# EAGLE design ExpansionHub (EAGLE 6.1)
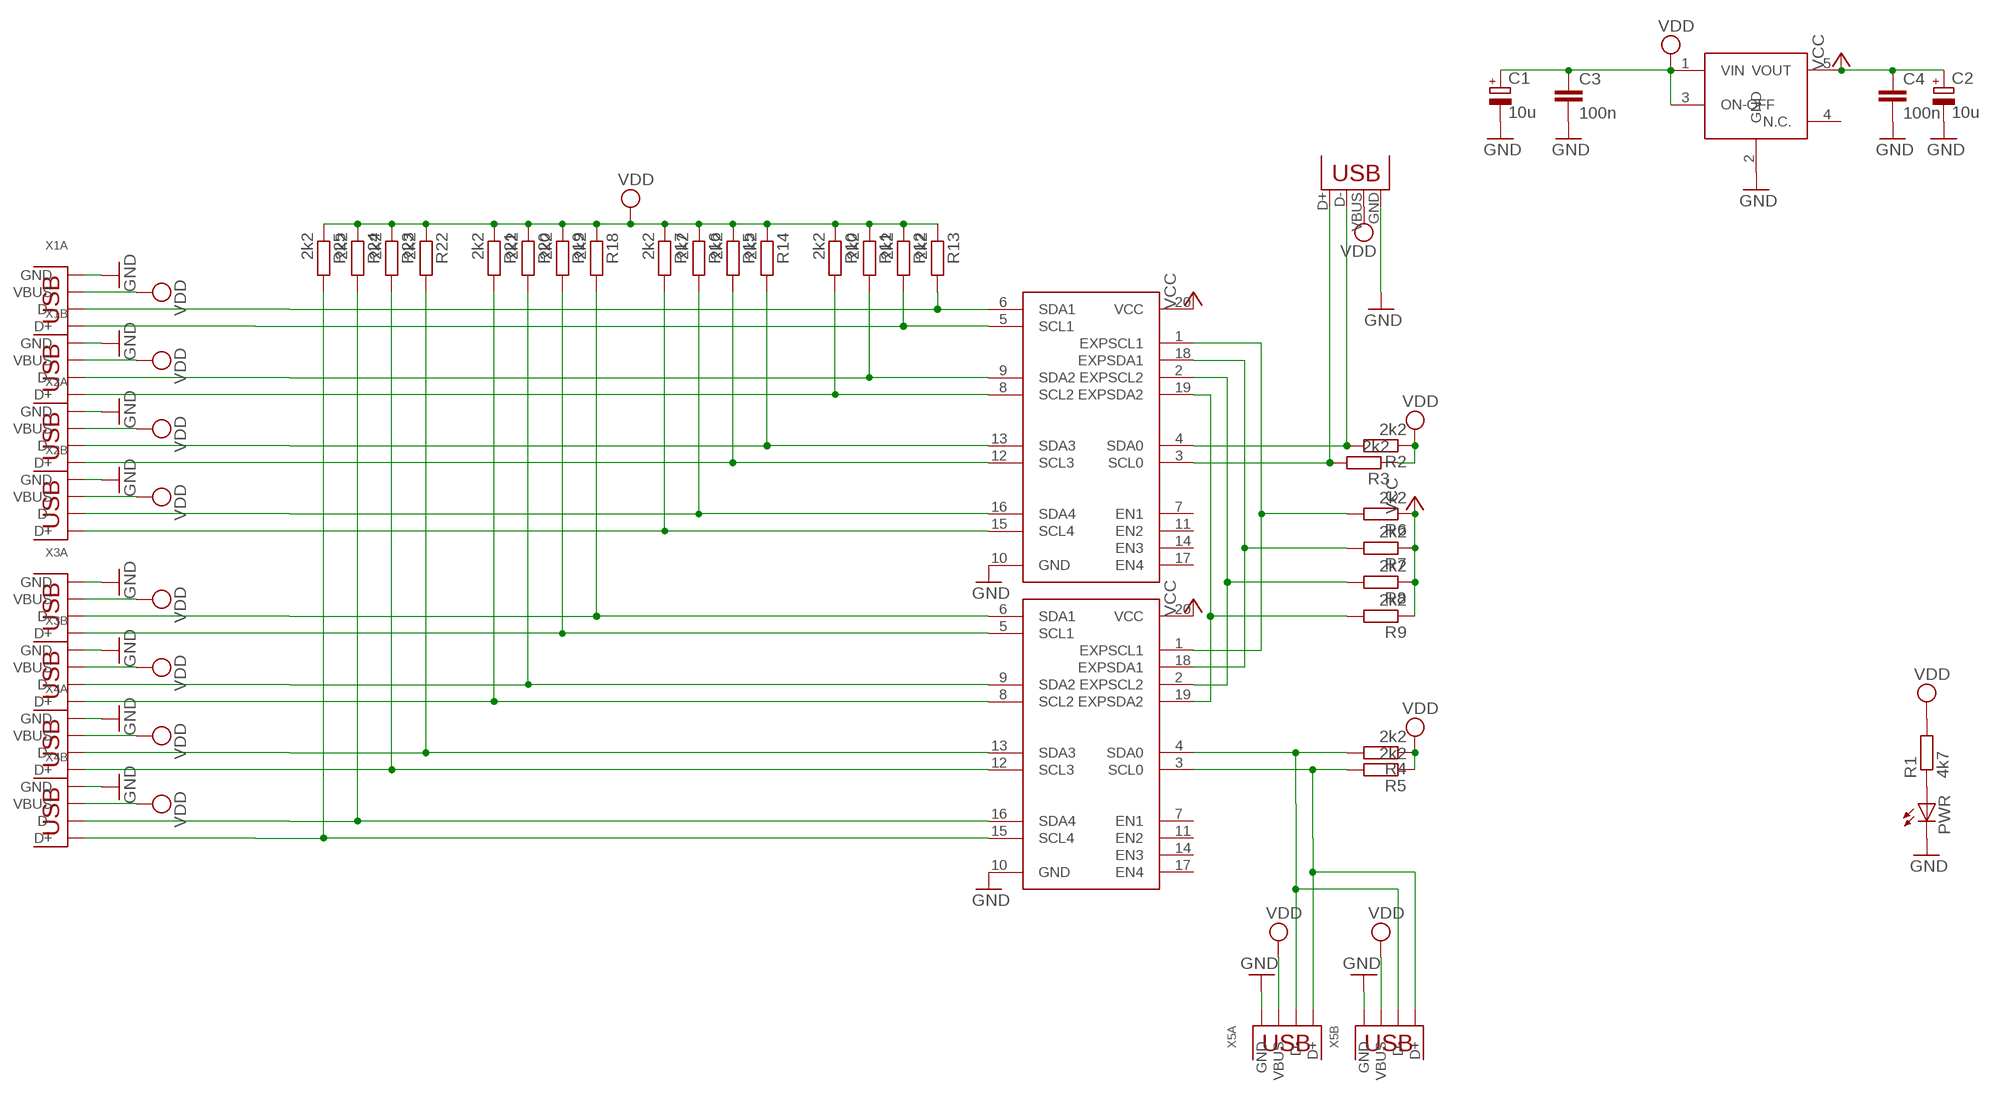
[diagram p0: schematic, sheet 1]

## Parts
C1  10u  CPOL-EUA/3216-18W  [A/3216-18W]
C2  10u  CPOL-EUA/3216-18W  [A/3216-18W]
C3  100n  C-EUC0805  [C0805]
C4  100n  C-EUC0805  [C0805]
IC1  PCA9518  [TSSOP20]
IC2  PCA9518  [TSSOP20]
PWR  LED3MM  [LED3MM]
R1  4k7  R-EU_R0805W  [R0805W]
R2  2k2  R-EU_R0805  [R0805]
R3  2k2  R-EU_R0805  [R0805]
R4  2k2  R-EU_R0805  [R0805]
R5  2k2  R-EU_R0805  [R0805]
R6  2k2  R-EU_R0805  [R0805]
R7  2k2  R-EU_R0805  [R0805]
R8  2k2  R-EU_R0805  [R0805]
R9  2k2  R-EU_R0805  [R0805]
R10  2k2  R-EU_R0805  [R0805]
R11  2k2  R-EU_R0805  [R0805]
R12  2k2  R-EU_R0805  [R0805]
R13  2k2  R-EU_R0805  [R0805]
R14  2k2  R-EU_R0805  [R0805]
R15  2k2  R-EU_R0805  [R0805]
R16  2k2  R-EU_R0805  [R0805]
R17  2k2  R-EU_R0805  [R0805]
R18  2k2  R-EU_R0805  [R0805]
R19  2k2  R-EU_R0805  [R0805]
R20  2k2  R-EU_R0805  [R0805]
R21  2k2  R-EU_R0805  [R0805]
R22  2k2  R-EU_R0805  [R0805]
R23  2k2  R-EU_R0805  [R0805]
R24  2k2  R-EU_R0805  [R0805]
R25  2k2  R-EU_R0805  [R0805]
U1  LP2985  [SOT23-5]
X1  DUA-USB  [DUAL]
X2  DUA-USB  [DUAL]
X3  DUA-USB  [DUAL]
X4  DUA-USB  [DUAL]
X5  DUA-USB  [DUAL]
X11  USBSMD  [USB-MINIB]

## Nets
GND [gnd]: C1.- C2.- C3.2 C4.2 IC1.10(GND) IC2.10(GND) PWR.K(C) U1.2(GND) X1.1-4(A:GND) X1.2-4(B:GND) X2.1-4(A:GND) X2.2-4(B:GND) X3.1-4(A:GND) X3.2-4(B:GND) X4.1-4(A:GND) X4.2-4(B:GND) X5.1-4(A:GND) X5.2-4(B:GND) X11.GND
N$1: IC1.19(EXPSDA2) IC2.19(EXPSDA2) R9.2
N$2: IC1.2(EXPSCL2) IC2.2(EXPSCL2) R8.2
N$3: IC1.18(EXPSDA1) IC2.18(EXPSDA1) R7.2
N$4: IC1.4(SDA0) R2.2 X11.D-
N$5: IC1.3(SCL0) R3.2 X11.D+
N$6: IC1.1(EXPSCL1) IC2.1(EXPSCL1) R6.2
N$7: IC2.3(SCL0) R5.2 X5.1-3(A:D+) X5.2-3(B:D+)
N$8: IC2.4(SDA0) R4.2 X5.1-2(A:D-) X5.2-2(B:D-)
N$9: IC1.9(SDA2) R11.2 X1.2-2(B:D-)
N$10: PWR.A R1.1
N$11: IC2.15(SCL4) R25.2 X4.2-3(B:D+)
N$12: IC1.8(SCL2) R10.2 X1.2-3(B:D+)
N$13: IC2.16(SDA4) R24.2 X4.2-2(B:D-)
N$14: IC1.12(SCL3) R15.2 X2.1-3(A:D+)
N$16: IC1.15(SCL4) R17.2 X2.2-3(B:D+)
N$18: IC2.5(SCL1) R19.2 X3.1-3(A:D+)
N$20: IC2.8(SCL2) R21.2 X3.2-3(B:D+)
N$22: IC2.12(SCL3) R23.2 X4.1-3(A:D+)
N$25: IC1.6(SDA1) R13.2 X1.1-2(A:D-)
N$26: IC1.13(SDA3) R14.2 X2.1-2(A:D-)
N$28: IC1.16(SDA4) R16.2 X2.2-2(B:D-)
N$30: IC2.6(SDA1) R18.2 X3.1-2(A:D-)
N$32: IC2.9(SDA2) R20.2 X3.2-2(B:D-)
N$34: IC2.13(SDA3) R22.2 X4.1-2(A:D-)
N$49: IC1.5(SCL1) R12.2 X1.1-3(A:D+)
VCC: C2.+ C4.1 IC1.20(VCC) IC2.20(VCC) R6.1 R7.1 R8.1 R9.1 U1.5(VOUT)
VDD: C1.+ C3.1 R1.2 R2.1 R3.1 R4.1 R5.1 R10.1 R11.1 R12.1 R13.1 R14.1 R15.1 R16.1 R17.1 R18.1 R19.1 R20.1 R21.1 R22.1 R23.1 R24.1 R25.1 U1.1(VIN) U1.3(ON-OFF) X1.1-1(A:VBUS) X1.2-1(B:VBUS) X2.1-1(A:VBUS) X2.2-1(B:VBUS) X3.1-1(A:VBUS) X3.2-1(B:VBUS) X4.1-1(A:VBUS) X4.2-1(B:VBUS) X5.1-1(A:VBUS) X5.2-1(B:VBUS) X11.VBUS
Unconnected: IC1.7(EN1) IC1.11(EN2) IC1.14(EN3) IC1.17(EN4) IC2.7(EN1) IC2.11(EN2) IC2.14(EN3) IC2.17(EN4) U1.4(N.C.)

## Library data of the parts
C1 C2 = rcl:CPOL-EU: POLARIZED CAPACITOR, European symbol
C3 C4 = rcl:C-EU: CAPACITOR, European symbol
IC1 IC2 = PCA95XX:PCA9518
PWR = led:LED: LED OSRAM: - CHIPLED LG R971, LG N971, LY N971, LG Q971, LY Q971, LO R971, LY R971 LH N974, LH R974 LS Q976, LO Q976, LY Q976 LO Q996 - Hyper CHIPLED LW Q18S LB Q993, LB Q99A, LB R99A - SideLED LS A670, LO A670, LY A670, LG A670, LP A670 LB A673, LV A673, LT A673, LW A673 LH A674 LY A675 LS A676, LA A676, LO A676, LY A676, LW A676 LS A679, LY A679, LG A679 - Hyper Micro SIDELED® LS Y876, LA Y876, LO Y876, LY Y876 LT Y87S - SmartLED LW L88C, LW L88S LB L89C, LB L89S, LG L890 LS L89K, LO L89K, LY L89K LS L896, LA L896, LO L896, LY L896 - TOPLED LS T670, LO T670, LY T670, LG T670, LP T670 LSG T670, LSP T670, LSY T670, LOP T670, LYG T670 LG T671, LOG T671, LSG T671 LB T673, LV T673, LT T673, LW T673 LH T674 LS T676, LA T676, LO T676, LY T676, LB T676, LH T676, LSB T676, LW T676 LB T67C, LV T67C, LT T67C, LS T67K, LO T67K, LY T67K, LW E67C LS E67B, LA E67B, LO E67B, LY E67B, LB E67C, LV E67C, LT E67C LW T67C LS T679, LY T679, LG T679 LS T770, LO T770, LY T770, LG T770, LP T770 LB T773, LV T773, LT T773, LW T773 LH T774 LS E675, LA E675, LY E675, LS T675 LS T776, LA T776, LO T776, LY T776, LB T776 LHGB T686 LT T68C, LB T68C - Hyper Mini TOPLED® LB M676 - Mini TOPLED Santana® LG M470 LS M47K, LO M47K, LY M47K Source: http://www.osram.convergy.de LUXEON: - LUMILED® LXK2-PW12-R00, LXK2-PW12-S00, LXK2-PW14-U00, LXK2-PW14-V00 LXK2-PM12-R00, LXK2-PM12-S00, LXK2-PM14-U00 LXK2-PE12-Q00, LXK2-PE12-R00, LXK2-PE12-S00, LXK2-PE14-T00, LXK2-PE14-U00 LXK2-PB12-K00, LXK2-PB12-L00, LXK2-PB12-M00, LXK2-PB14-N00, LXK2-PB14-P00, LXK2-PB14-Q00 LXK2-PR12-L00, LXK2-PR12-M00, LXK2-PR14-Q00, LXK2-PR14-R00 LXK2-PD12-Q00, LXK2-PD12-R00, LXK2-PD12-S00 LXK2-PH12-R00, LXK2-PH12-S00 LXK2-PL12-P00, LXK2-PL12-Q00, LXK2-PL12-R00 Source: www.luxeon.com KINGBRIGHT: KA-3528ASYC Source: www.kingbright.com
R1-R25 = rcl:R-EU_: RESISTOR, European symbol
U1 = LP2985:LP2985
X1-X5 = con-cypressindustries:DUA-USB
X11 = SparkFun:USB: USB Connectors USB-B-PTH is fully proven SKU : PRT-00139 USB-miniB is fully proven SKU : PRT-00587 USB-A-PCB is untested. USB-A-H is throughly reviewed, but untested. Spark Fun Electronics SKU : PRT-00437 USB-B-SMT is throughly reviewed, but untested. Needs silkscreen touching up. USB-A-S has not been used/tested USB-MB-H has not been used/tested

## Net classes
0 default: width 0.305 mm, drill 0.305 mm, clearance 0.203 mm
2 gnd: width 0.305 mm, drill 0.305 mm, clearance 0.203 mm

## Board
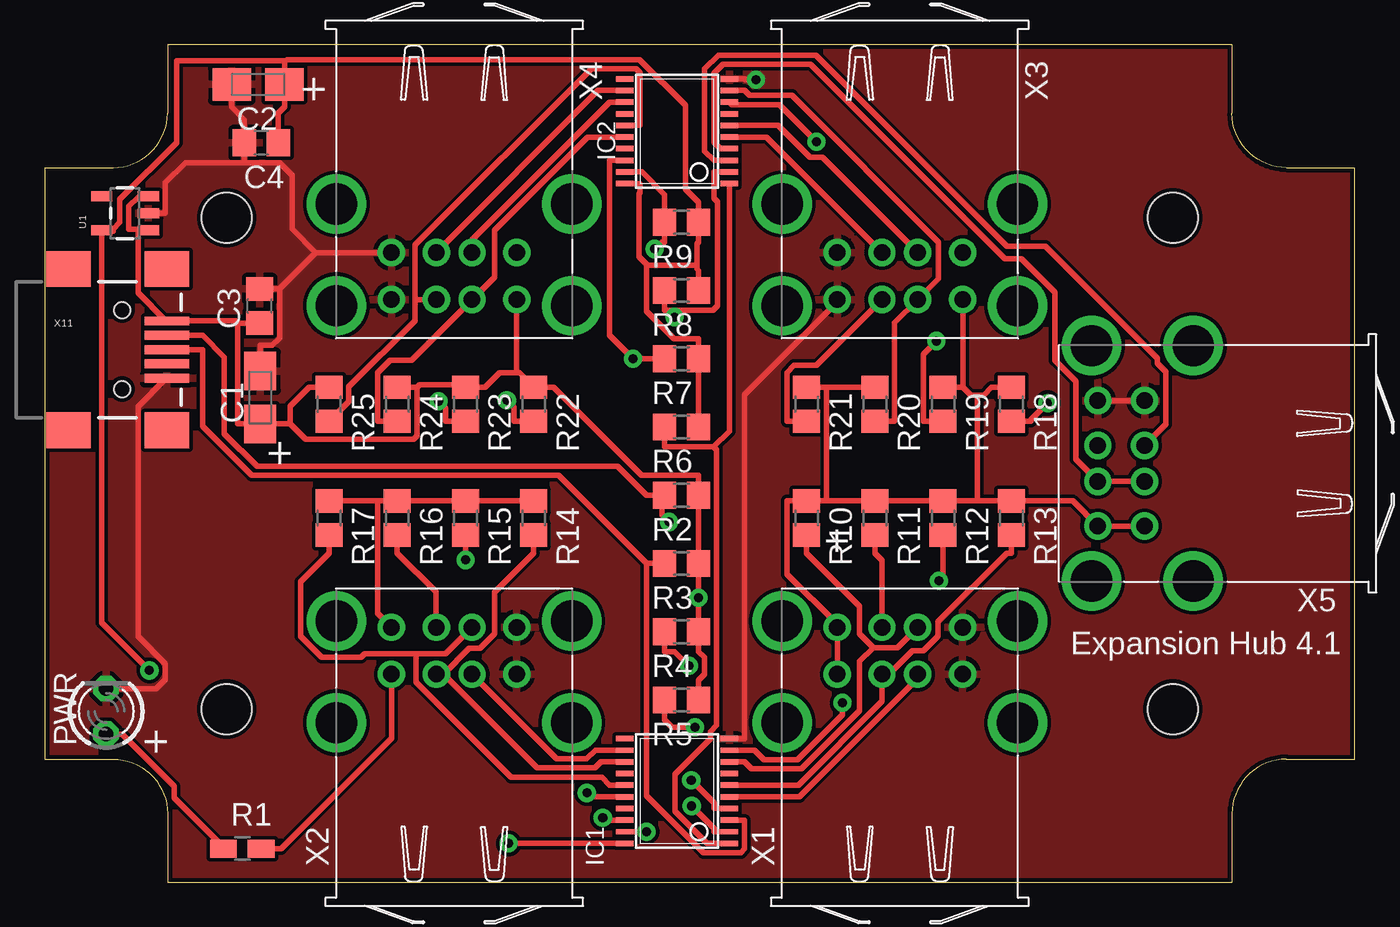
[diagram p1: board, top side]
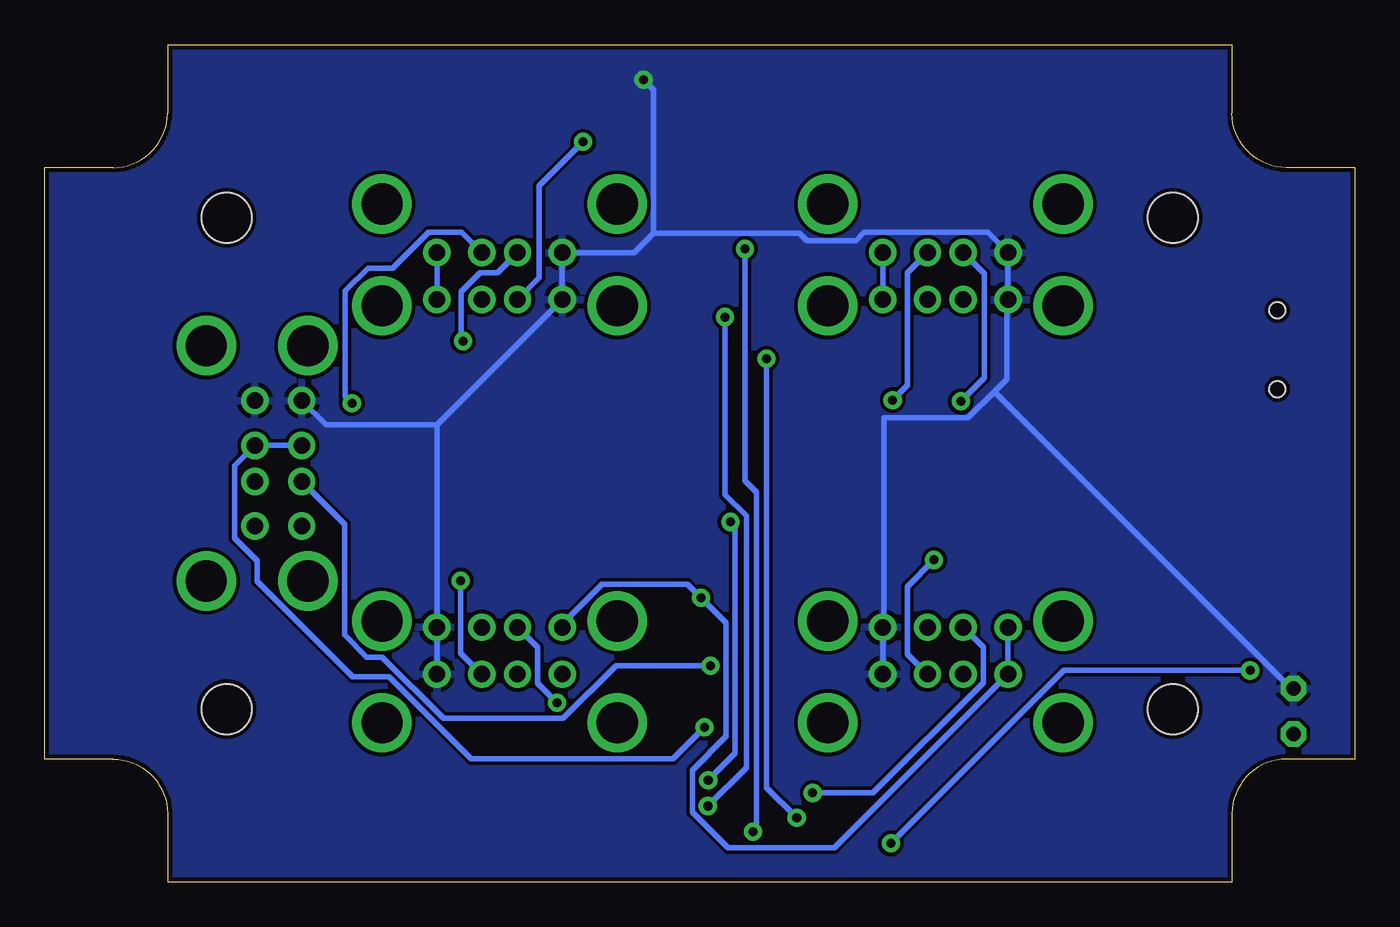
[diagram p2: board, bottom side, seen from below]

Size 73.15 x 46.74 mm. Coordinates in mm from the lower left corner, seen from the top.
Outline: 0,39.88 0,6.86 3.81,6.86 arc-90 6.86,3.81 6.86,0 66.29,0 66.29,3.81 arc-90 69.34,6.86 73.15,6.86 73.15,39.88 69.34,39.88 arc-90 66.29,42.93 66.29,46.74 6.86,46.74 6.86,42.93 arc-90 3.81,39.88 0,39.88
Copper layers (1*16): Top 0.035mm / dielectric 1.5mm / Bottom 0.035mm
Design rules: minimum track width 8mil, minimum drill 20mil, track to track 8mil, track to pad 8mil, pad to pad 8mil, via to via 8mil, smd to smd 8mil, copper to edge 10mil, drill to drill 8mil, minimum pad ring 12mil, minimum via ring 10mil, stop-mask expansion 4mil, vias tented up to drill 25mil, thermal gap 10mil
Holes 2.8 mm at 10.16,37.08 10.16,9.65 62.99,9.65 62.99,37.08

### Footprints (pad centres in the part's own frame; a part is rotated, then mirrored left to right if it is on the bottom)
A/3216-18W = smd 2.15 x 1.8: + 1.475,0; - -1.475,0
C0805 = smd 1.3 x 1.5: 1 -0.95,0; 2 0.95,0
TSSOP20 = smd 0.305 x 0.991: 1 -2.925,-2.918; 2 -2.275,-2.918; 3 -1.625,-2.918; 4 -0.975,-2.918; 5 -0.325,-2.918; 6 0.325,-2.918; 7 0.975,-2.918; 8 1.625,-2.918; 9 2.275,-2.918; 10 2.925,-2.918; 11 2.925,2.918; 12 2.275,2.918; 13 1.625,2.918; 14 0.975,2.918; 15 0.325,2.918; 16 -0.325,2.918; 17 -0.975,2.918; 18 -1.625,2.918; 19 -2.275,2.918; 20 -2.925,2.918
LED3MM = drill 0.813 octagon: A -1.27,0; K 1.27,0
R0805W = smd 1.5 x 1: 1 -1.052,0; 2 1.052,0
R0805 = smd 1.3 x 1.5: 1 -0.95,0; 2 0.95,0
SOT23-5 = smd 0.55 x 1.2: 1 -0.95,-1.3; 2 0,-1.3; 3 0.95,-1.3; 4 0.95,1.3; 5 -0.95,1.3
DUAL = drill 0.92 pad 1.27: 1-1 3.98,3.5; 1-2 3.98,1; 1-3 3.98,-1; 1-4 3.98,-3.5; 2-1 6.6,3.5; 2-2 6.6,1; 2-3 6.6,-1; 2-4 6.6,-3.5 | drill 2.3 pad 3: M1 1.27,6.57; M2 1.27,-6.57; M3 6.95,6.57; M4 6.95,-6.57
USB-MINIB = smd 2.5 x 0.5: D+ 2.5,0; D- 2.5,0.8; GND 2.5,-1.6; ID 2.5,-0.8; VBUS 2.5,1.6 | smd 2.5 x 2: GND@1 -3,-4.5; GND@2 -3,4.5; GND@3 2.5,4.5; GND@4 2.5,-4.5 | hole 0.9: 0,2.2; 0,-2.2

### Placement (x,y rotation side)
C1  12.03,27.05 270 top
C2  11.91,44.52 0 top
C3  12,32.16 90 top
C4  12.1,41.26 180 top
IC1  35.31,5.08 90 top
IC2  35.31,41.91 90 top
PWR  3.43,9.53 90 top
R1  11.03,1.86 0 top
R2  35.56,21.59 180 top
R3  35.56,17.78 180 top
R4  35.56,13.97 180 top
R5  35.56,10.16 180 top
R6  35.56,25.4 180 top
R7  35.56,29.21 180 top
R8  35.56,33.02 180 top
R9  35.56,36.83 180 top
R10  42.55,20.32 270 top
R11  46.35,20.32 270 top
R12  50.16,20.32 270 top
R13  53.98,20.32 270 top
R14  27.3,20.32 270 top
R15  23.5,20.32 270 top
R16  19.68,20.32 270 top
R17  15.88,20.32 270 top
R18  53.98,26.67 270 top
R19  50.16,26.67 270 top
R20  46.35,26.67 270 top
R21  42.55,26.67 270 top
R22  27.3,26.67 270 top
R23  23.5,26.67 270 top
R24  19.68,26.67 270 top
R25  15.88,26.67 270 top
U1  4.48,37.34 90 top
X1  47.75,7.62 90 top
X2  22.86,7.62 90 top
X3  47.75,39.12 270 top
X4  22.86,39.12 270 top
X5  65.41,23.37 180 top
X11  4.32,29.72 0 top

### Tracks (layer width: path | path; a pad name or v marks a point on that pad's centre or on a via)
GND  (via drill 0.51 pad 1.02)
  Top 0.305: v39.72,44.78 39.13,44.78 39.08,44.84 IC2.10 | IC1.10 39.08,8.01 39.08,27.2 44.25,32.38 X3.2-4 | 15.14,35.14 13.11,33.1 | X4.1-4 15.14,35.14 | 11.14,40.15 13.12,40.15 13.8,39.47 13.8,36.47 15.14,35.14 | 11.14,40.15 7.87,40.15 6.74,39.02 6.74,37.34 U1.2 | 13.11,33.1 13.11,30.35 12.7,29.95 12.03,29.95 C1.- | 13.11,33.1 12.98,33.1 C3.2 | 11.14,40.15 C4.2 11.14,42.56 10.44,43.27 C2.- | X5.1-4 X5.2-4 | PWR.K 6.22,10.79 6.73,11.3 6.73,12.06 6.73,12.19 5.21,13.72 5.21,26.54 6.73,28.07 X11.GND 6.99,28.07
  Bottom 0.305: 39.17,36.22 39.17,44.23 v39.72,44.78 | 39.17,36.22 40.25,35.14 X3.1-4 X3.2-4 51.25,25.52 | 39.17,36.22 30.99,36.22 30.59,35.81 27.86,35.81 27.4,36.27 20.5,36.27 X4.1-4 X4.2-4 19.43,32.38 19.43,28.07 20.13,27.37 | 51.25,25.52 X1.2-4 X1.1-4 | X5.2-4 57.45,25.52 51.25,25.52 | X2.1-4 X2.2-4 26.29,14.35 26.29,25.91 21.59,25.91 20.13,27.37 | PWR.K 3.56,10.79 20.07,27.3 20.13,27.37
  pour Bottom: -1.27,52.07 73.66,52.07 73.66,-1.27 -1.27,-1.27
  pour Top: -1.27,50.8 73.66,50.8 73.66,-1.27 -1.27,-1.27
N$1  (via drill 0.51 pad 1.02)
  Top 0.305: v33.6,2.81 33.24,2.81 IC1.19 | v34.05,35.34 34.44,35.72 34.61,35.72 R9.2 34.61,38.38 33.35,39.63 IC2.19
  Bottom 0.305: v34.05,35.34 34.05,22.39 33.41,21.75 33.41,3 v33.6,2.81
N$2  (via drill 0.51 pad 1.02)
  Top 0.305: 35.16,31.91 37.31,31.91 37.55,32.16 37.55,37.98 37.37,38.16 37.37,39.63 IC2.2 | 35.16,31.91 34.61,31.91 R8.2 | 35.16,31.91 v35.16,31.54 | IC1.2 37.37,2.81 37.37,3 v36.12,4.24
  Bottom 0.305: v36.12,4.24 33.98,6.39 33.98,20.44 35.16,21.62 v35.16,31.54
N$3  (via drill 0.51 pad 1.02)
  Top 0.305: v31.16,3.58 31.41,3.58 31.54,3.46 IC1.18 | R7.2 33.73,29.21 v32.85,29.21 31.54,30.52 31.54,40.28 IC2.18
  Bottom 0.305: v32.85,29.21 32.85,5.27 v31.16,3.58
N$4  (via drill 0.51 pad 1.02)
  Top 0.305: 34.48,21.59 34.48,20.49 v34.87,20.1 | v36.1,5.68 37.37,4.41 37.37,4.11 IC1.4 | 34.48,21.59 33.6,21.59 31.99,23.2 11.85,23.2 10.02,25.03 10.02,29.3 8.8,30.52 X11.D- | R2.2 34.48,21.59
  Bottom 0.305: v36.1,5.68 34.6,7.18 34.6,19.84 v34.87,20.1
N$5
  Top 0.305: IC1.3 39.08,3.46 39.08,1.85 38.87,1.65 36.78,1.65 33.6,4.82 33.6,17.78 | 33.6,17.78 33.73,17.78 R3.2 | X11.D+ 8.8,29.72 8.8,25.45 11.56,22.69 28.69,22.69 33.6,17.78
N$6
  Top 0.305: 37.35,24.29 37.52,24.13 37.52,8.74 37.17,8.39 37.17,7.99 35.2,6.01 35.2,3.95 36.99,2.15 37.37,2.15 IC1.1 | 37.35,24.29 34.61,24.29 R6.2 | IC2.1 38.22,25.17 37.35,24.29
N$7  (via drill 0.51 pad 1.02)
  Top 0.305: IC2.3 37.37,40.28 36.85,40.8 36.85,45.39 37.63,46.16 43.06,46.16 53.74,35.48 55.87,35.48 62.12,29.23 62.12,28.95 62.6,28.47 62.6,25.55 X5.1-3 | R5.2 34.61,9.05 35.03,8.63 v36.31,8.63
  Bottom 0.305: v36.31,8.63 38.07,6.87 49.36,6.87 53.94,11.45 55.96,11.45 61.3,16.78 61.3,17.92 62.55,19.18 62.55,23.24 X5.1-3 X5.2-3
N$8  (via drill 0.51 pad 1.02)
  Top 0.305: IC2.4 37.72,40.94 37.37,41.28 37.37,45.16 37.87,45.65 42.74,45.65 53.6,34.79 54.54,34.79 56.41,32.93 56.41,29.11 57.57,27.96 57.57,23.61 X5.2-2 X5.1-2 | R4.2 34.61,12.86 35.18,12.86 v35.98,12.06
  Bottom 0.305: v35.98,12.06 41.26,12.06 44.2,9.13 50.89,9.13 54.31,12.56 55.17,12.56 56.41,13.79 56.41,19.97 X5.2-2
N$9  (via drill 0.51 pad 1.02)
  Top 0.305: R11.2 46.35,18.36 46.75,17.97 X1.2-2 | v44.55,10.01 44.55,9.34 42.04,6.83 40.15,6.83 39.63,7.36 IC1.9
  Bottom 0.305: X1.2-2 45.63,13.1 45.63,11.09 v44.55,10.01
N$10
  Top 0.305: 9.91,1.91 R1.1 9.91,2.03 7.24,4.7 7.24,5.33 4.32,8.26 PWR.A
N$11
  Top 0.305: 20.69,32.52 X4.2-3 | R25.2 16.98,26.82 16.98,27.64 20.69,31.34 20.69,32.52 | 20.69,32.52 20.69,35.56 30.52,45.39 33.02,45.39 33.24,45.17 33.24,42.23 IC2.15
N$12
  Top 0.305: IC1.8 39.08,6.71 39.47,6.31 42.26,6.31 45.5,9.55 45.5,12.33 46.26,13.09 | 46.26,13.09 45.5,13.85 45.5,15.41 42.55,18.36 R10.2 | X1.2-3 47.62,13.09 46.26,13.09
N$13
  Top 0.305: IC2.16 30.31,41.59 25.11,36.39 25.11,33.77 X4.2-2 20.48,29.14 19.29,29.14 18.58,28.42 18.58,25.72 R24.2
N$14  (via drill 0.51 pad 1.02)
  Top 0.305: v23.5,17.98 R15.2 | X2.1-3 28.58,6.88 30.26,6.88 30.74,7.36 IC1.12
  Bottom 0.305: X2.1-3 24.98,12.73 24.98,16.49 v23.5,17.98
N$16
  Top 0.305: 20.73,12.73 22.37,12.73 X2.2-3 | 20.73,12.73 20.73,11.14 26.04,5.84 31.11,5.84 31.54,5.41 IC1.15 | 20.73,12.73 17.85,12.73 17.67,12.55 15.46,12.55 14.28,13.73 14.28,16.77 15.88,18.36 R17.2
N$18  (via drill 0.51 pad 1.02)
  Top 0.305: R19.2 49.06,25.72 49.06,29.46 v49.79,30.2 | X3.1-3 40.3,41.59 IC2.5
  Bottom 0.305: X3.1-3 47.87,34.02 48.84,34.02 49.89,32.96 49.89,30.3 v49.79,30.2
N$20  (via drill 0.51 pad 1.02)
  Top 0.305: v43.09,41.32 41.02,43.39 38.37,43.39 IC2.8 | X3.2-3 43.09,28.85 41.85,28.85 41.44,28.44 41.44,25.72 R21.2
  Bottom 0.305: X3.2-3 45.55,33.72 45.55,38.86 v43.09,41.32
N$22  (via drill 0.51 pad 1.02)
  Top 0.305: IC2.12 30.91,44.19 X4.1-3 | v21.99,26.84 22.39,26.44 22.39,25.72 R23.2
  Bottom 0.305: X4.1-3 20.69,33.96 20.69,28.14 v21.99,26.84
N$25
  Top 0.305: IC1.6 42.08,5.41 46.75,10.08 X1.1-2 47.14,11.6 48.45,12.91 49.07,12.91 49.88,13.72 49.88,14.52 53.72,18.36 53.98,18.36 R13.2
N$26
  Top 0.305: 22.26,11.6 23.71,13.04 24.3,13.04 25.11,13.85 25.11,16.17 27.3,18.36 R14.2 | X2.1-2 21.96,11.6 22.26,11.6 | 22.26,11.6 | 22.26,11.6 27.49,6.37 30.73,6.37 31.07,6.71 IC1.13
N$28  (via drill 0.51 pad 1.02)
  Top 0.305: v30.27,4.97 30.49,4.75 IC1.16 | R16.2 19.68,18.36 21.86,16.19 X2.2-2
  Bottom 0.305: X2.2-2 20.74,13.1 20.74,11.13 26.9,4.97 v30.27,4.97
N$30  (via drill 0.51 pad 1.02)
  Top 0.305: X3.1-2 43.43,40.46 42.73,40.46 40.95,42.23 39.08,42.23 IC2.6 | R18.2 55.08,25.72 55.08,25.82 v56,26.73
  Bottom 0.305: X3.1-2 49.88,36.26 51.72,36.26 53.72,34.26 55.11,34.26 56.37,32.99 56.37,27.11 v56,26.73
N$32
  Top 0.305: IC2.9 39.08,44.19 39.35,43.91 41.72,43.91 49.91,35.72 49.91,33.68 X3.2-2 47.46,31.23 47.46,25.72 R20.2
N$34  (via drill 0.51 pad 1.02)
  Top 0.305: X4.1-2 23.86,35.86 31.54,43.53 IC2.13 | v25.8,26.9 26.2,26.5 26.2,25.72 R22.2
  Bottom 0.305: X4.1-2 24.98,34.02 24.98,27.72 v25.8,26.9
N$49  (via drill 0.51 pad 1.02)
  Top 0.305: IC1.5 42.14,4.75 48.75,11.36 X1.1-3 | v49.93,16.82 50.16,17.06 R12.2
  Bottom 0.305: X1.1-3 49.93,12.78 v49.93,16.82
VCC  (via drill 0.51)
  Top 0.305: 33.66,34.43 33.19,34.9 33.19,38.42 33.24,38.48 33.24,38.98 IC2.20 | 36.41,34.43 33.66,34.43 | 33.66,34.43 33.6,34.37 33.6,31.86 35.15,30.32 36.51,30.32 R7.1 R6.1 | 36.41,34.43 36.41,35.62 36.51,35.72 36.51,36.68 R9.1 36.51,37.94 35.77,38.68 35.77,43.37 33.22,45.91 13.52,45.91 13.39,45.78 | 36.41,34.43 36.41,34.23 36.51,34.13 R8.1 | 13.39,45.78 C2.+ 13.39,43.27 13.04,42.92 C4.1 | U1.5 3.66,36.38 3.81,36.32 | v25.91,2.16 IC1.20 | 13.39,45.78 13.34,45.85 7.37,45.85 7.37,41.27 4.19,38.1 4.19,36.83 3.81,36.45 3.68,36.45 U1.5 | v5.84,11.81 3.17,14.48 3.17,36.32 U1.5
  Bottom 0.305: v25.91,2.16 16.26,11.81 v5.84,11.81
VDD  (via drill 0.51 pad 1.02)
  Top 0.305: 26.36,28.41 26.51,28.41 R22.1 28.41,27.62 33.34,22.7 36.51,22.7 R2.1 R3.1 v36.51,15.88 R4.1 36.51,12.86 36.84,12.53 36.84,11.6 36.51,11.27 R5.1 | 26.36,28.41 25.39,28.41 24.6,27.62 R23.1 23.36,27.76 20.93,27.76 20.79,27.62 | X4.2-1 26.36,28.41 | 13.71,25.57 13.71,26.56 14.77,27.62 R25.1 | 20.79,27.62 20.79,24.91 20.59,24.71 14.57,24.71 13.71,25.57 | 13.71,25.57 13.29,25.57 C1.+ 10.77,25.57 10.77,31.2 | 10.77,31.2 10.78,31.2 10.89,31.2 C3.1 | 10.77,31.2 10.65,31.32 X11.VBUS 6.73,31.37 5.21,32.89 5.21,36.32 U1.1 5.71,36.45 4.7,36.45 4.7,37.72 5.21,38.23 5.71,38.23 U1.3 | X3.2-1 51.27,32.5 51.27,27.62 | R19.1 51.27,27.62 | 52.07,27.19 51.7,27.19 51.27,27.62 | 52.07,27.19 52.44,27.19 52.87,27.62 R18.1 | 52.07,27.19 52.07,21.27 | 43.65,27.62 45.25,27.62 R20.1 | 43.65,21.27 43.65,27.62 | 43.65,21.27 R11.1 R12.1 52.07,21.27 | 43.65,21.27 R10.1 41.44,21.27 41.44,17.19 44.25,14.38 X1.2-1 X1.1-1 | R21.1 43.65,27.62 | R24.1 20.79,27.62 | R14.1 R15.1 R16.1 18.58,21.27 | R1.2 13.19,1.86 19.36,8.04 X2.1-1 | 52.07,21.27 R13.1 57.4,21.27 X5.2-1 X5.1-1 | 18.58,21.27 16.98,21.27 R17.1 | X2.2-1 18.58,15 18.58,21.27
  Bottom 0.305: X1.2-1 44.25,14.4 42.02,16.63 37.27,16.63 v36.51,15.88 35.11,14.48 35.11,8.13 36.99,6.25 36.99,3.89 35.01,1.91 29.05,1.91 X2.1-1 X2.2-1 | X4.1-1 X4.2-1 | X3.2-1 X3.1-1

### Text on the board
tPlace: + | + | + | Expansion Hub 4.1 | +